# Altium project Yapa2.PrjPcb
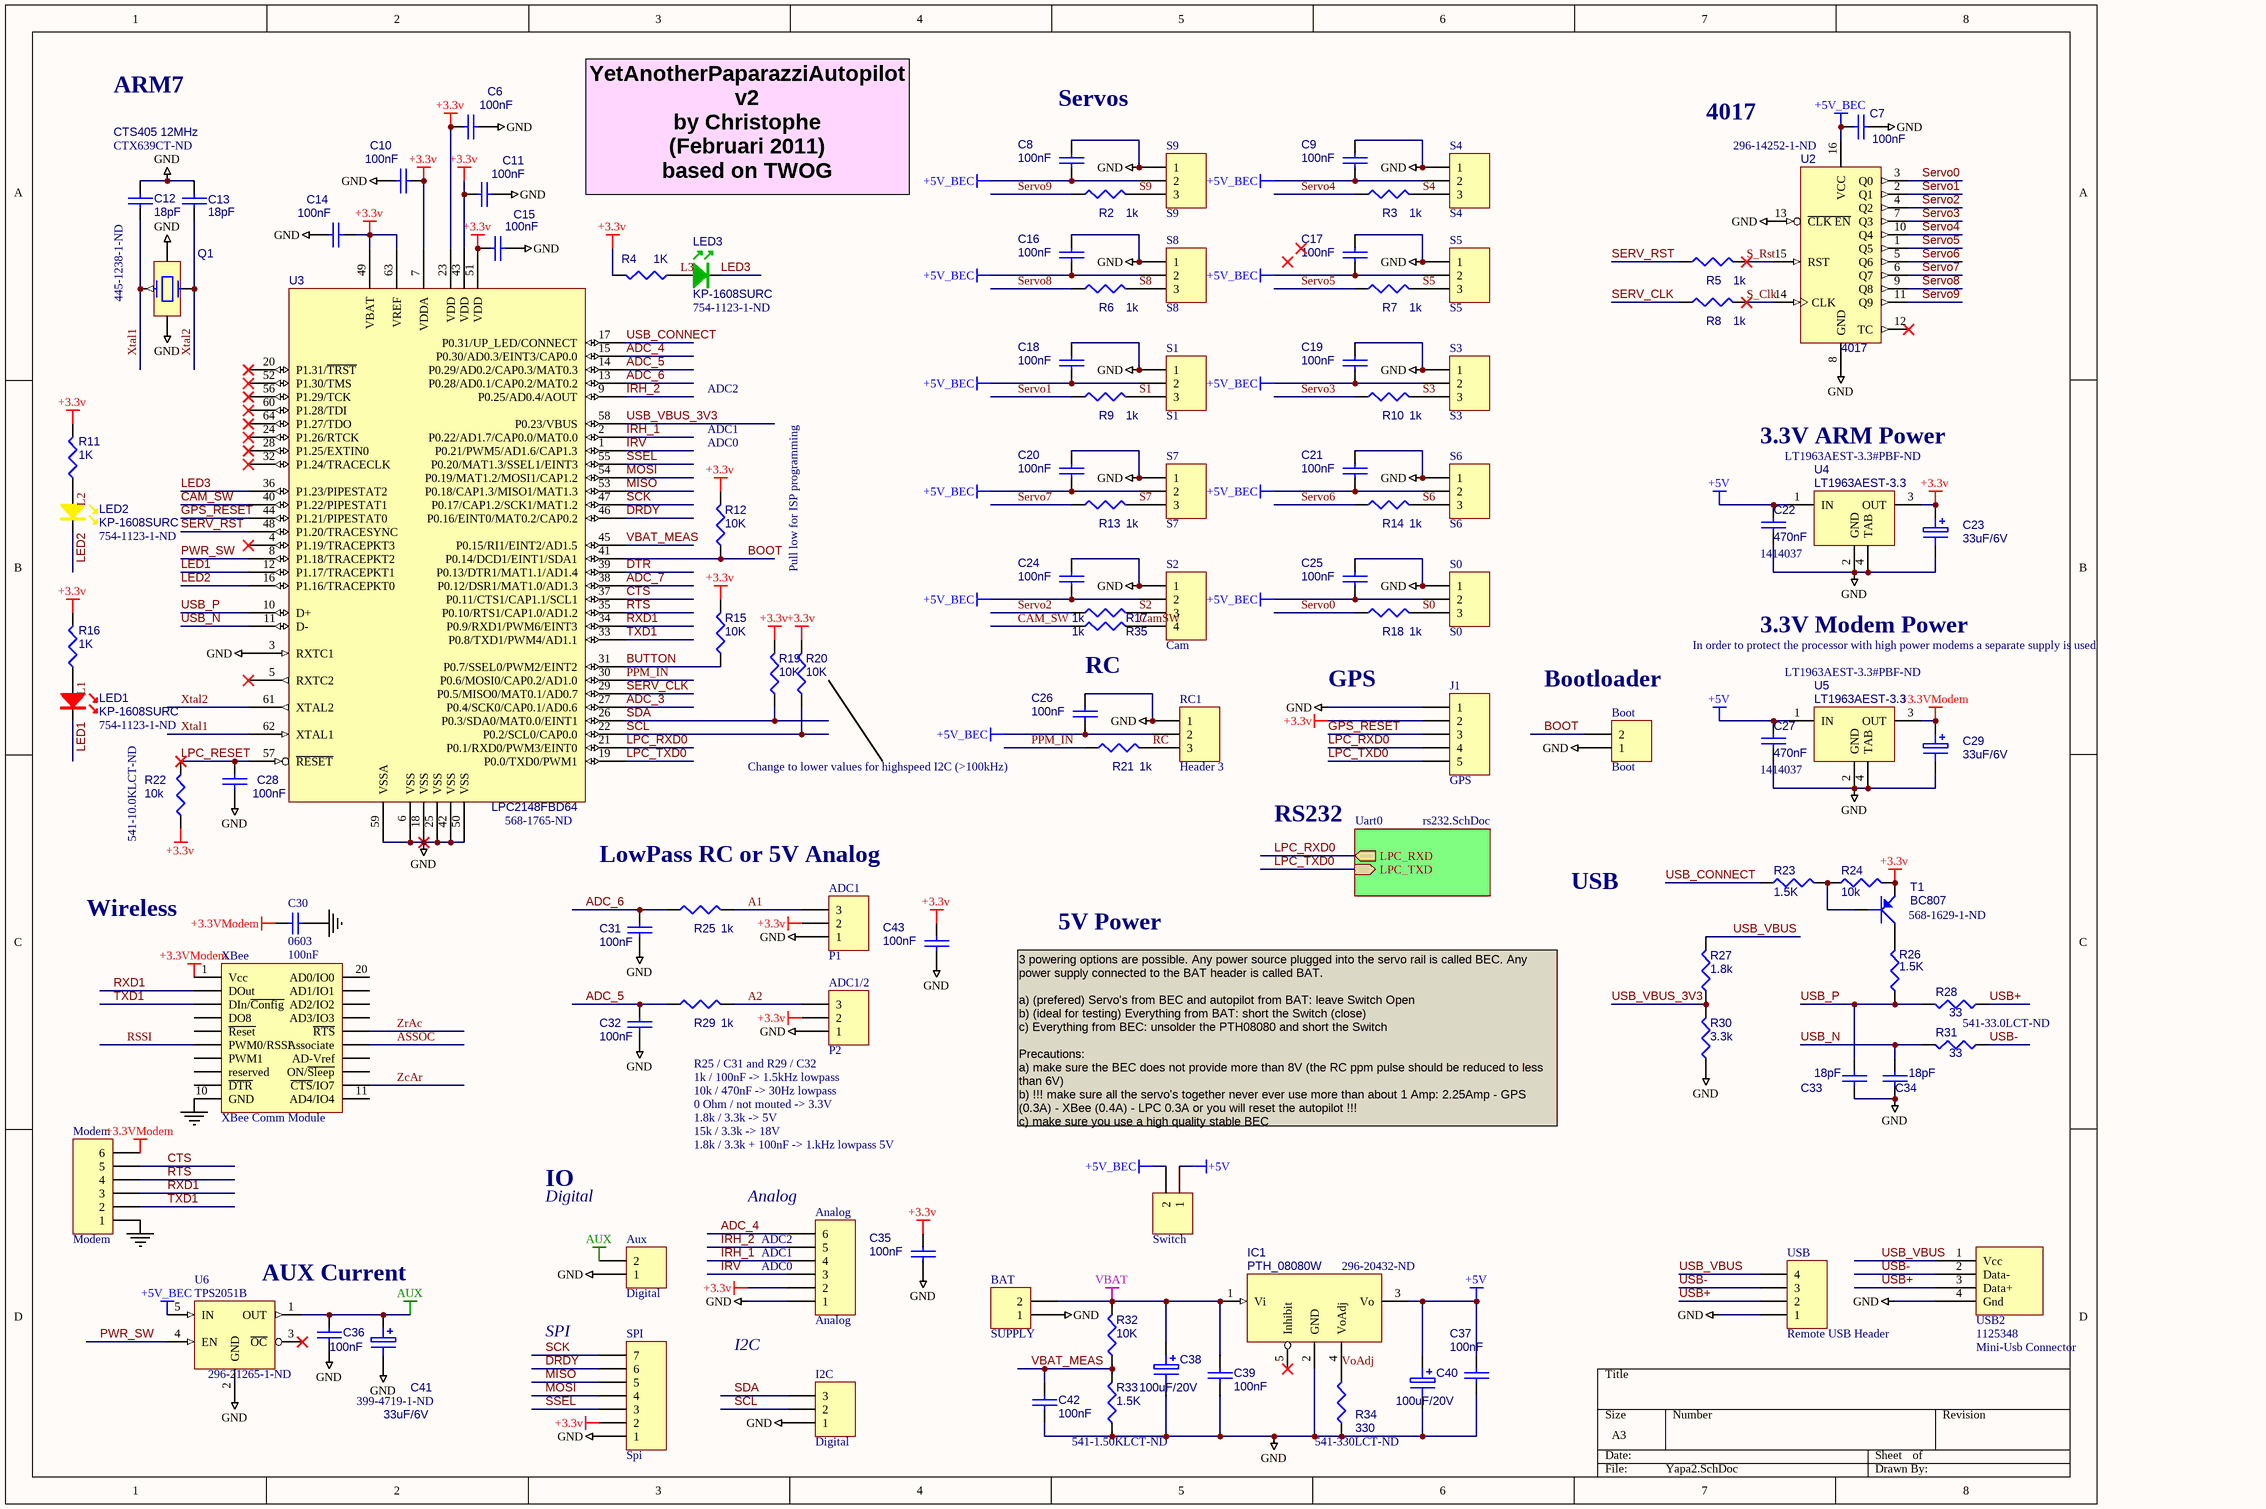
[diagram p0: Yapa2.SchDoc]
2 sheets, 116 parts. Net scope: hierarchical (ports join the sheet entries above them; power ports are global).
Board file: Yapa2.PcbDoc
Sheets:
  Yapa2.SchDoc
    Uart0 = rs232.SchDoc

## Sheet Yapa2.SchDoc
size A3; PageSetup: Record=PageOptions|CenterHorizontal=True|CenterVertical=True|PrintScale=1.00|XCorrection=1.00|YCorrection=1.00|PrintKind=0|BorderSize=5000000|LeftOffset=0|BottomOffset=0|Orientation=2|PaperLength=1000|PaperWidth=1000|Scale=100|PaperSource=7|PrintQuality=-4|MediaType=1|DitherType=10|PaperKind=A4|PrintScaleMode=1

### Parts
ADC1  P1  [HDR3]
ADC1/2  P2  [HDR3]
Analog  Analog  [HDR6]
Aux  Digital  [HDR2]
BAT  SUPPLY  [HDR1X2]
Boot  Boot  [HDR1X2]
C6  100nF  [0603]
C7  100nF  [0603]
C8  100nF  [0603]
C9  100nF  [0603]
C10  100nF  [0603]
C11  100nF  [0603]
C12  18pF  Supplier Part Number 1: 445-1238-1-ND  [0603]
C13  18pF  [0603]
C14  100nF  [0603]
C15  100nF  [0603]
C16  100nF  [0603]
C17  100nF  [0603]
C18  100nF  [0603]
C19  100nF  [0603]
C20  100nF  [0603]
C21  100nF  [0603]
C22  470nF  farnell: 1414037  [0805]
C23  33uF/6V  [T491A]
C24  100nF  [0603]
C25  100nF  [0603]
C26  100nF  [0603]
C27  470nF  farnell: 1414037  [0805]
C28  100nF  [0603]
C29  33uF/6V  [T491A]
C30  0603  value 100nF  [0603]
C31  100nF  [0603]
C32  100nF  [0603]
C33  18pF  [0603]
C34  18pF  [0603]
C35  100nF  [0603]
C36  100nF  [0603]
C37  100nF  [0603]
C38  100uF/20V  [T491D]
C39  100nF  [0603]
C40  100uF/20V  [T491D]
C41  33uF/6V  Supplier Part Number 1: 399-4719-1-ND  [T491A]
C42  100nF  [0603]
C43  100nF  [0603]
I2C  Digital  [HDR3]
IC1  PTH_08080W  Supplier Part Number 1: 296-20432-ND  [PTH_08080W]
J1  GPS  [HDR5]
LED1  KP-1608SURC  Supplier Part Number 1: 754-1123-1-ND  [KP-1608SURC]
LED2  KP-1608SURC  Supplier Part Number 1: 754-1123-1-ND  [KP-1608SURC]
LED3  KP-1608SURC  Supplier Part Number 1: 754-1123-1-ND  [KP-1608SURC]
Modem  Modem  [HDR1X6]
Q1  CTS405 12MHz  Supplier Part Number 1: CTX639CT-ND  [CTS_405]
R2  1k  [0603RES]
R3  1k  [0603RES]
R4  1K  [0603RES]
R5  1k  [0603RES]
R6  1k  [0603RES]
R7  1k  [0603RES]
R8  1k  [0603RES]
R9  1k  [0603RES]
R10  1k  [0603RES]
R11  1K  [0603RES]
R12  10K  [0603RES]
R13  1k  [0603RES]
R14  1k  [0603RES]
R15  10K  [0603RES]
R16  1K  [0603RES]
R17  1k  [0603RES]
R18  1k  [0603RES]
R19  10K  [0603RES]
R20  10K  [0603RES]
R21  1k  [0603RES]
R22  10k  Supplier Part Number 1: 541-10.0KLCT-ND  [0603RES]
R23  1.5K  [0603RES]
R24  10k  [0603RES]
R25  1k  [0603RES]
R26  1.5K  [0603RES]
R27  1.8k  [0603RES]
R28  33  Supplier Part Number 1: 541-33.0LCT-ND  [0603RES]
R29  1k  [0603RES]
R30  3.3k  [0603RES]
R31  33  [0603RES]
R32  10K  [0603RES]
R33  1.5K  Supplier Part Number 2: 541-1.50KLCT-ND  [0603RES]
R34  330  Supplier Part Number 1: 541-330LCT-ND  [0603RES]
R35  1k  [0603RES]
RC1  Header 3  [HDR3]
S0  S0  [HDR3]
S1  S1  [HDR3]
S2  Cam  [HDR4]
S3  S3  [HDR3]
S4  S4  [HDR3]
S5  S5  [HDR3]
S6  S6  [HDR3]
S7  S7  [HDR3]
S8  S8  [HDR3]
S9  S9  [HDR3]
SPI  Spi  [HDR7]
Switch  SUPPLY  [HDR1X2]  (value not drawn)
T1  BC807  Supplier Part Number 1: 568-1629-1-ND  [BC807]
U2  4017  Supplier Part Number 1: 296-14252-1-ND  [4017PW]
U3  LPC2148FBD64  Supplier Part Number 1: 568-1765-ND  [LPC2148FBD64]
U4  LT1963AEST-3.3  Supplier Part Number 1: LT1963AEST-3.3#PBF-ND  [LM3940IMP-3.3]
U5  LT1963AEST-3.3  Supplier Part Number 1: LT1963AEST-3.3#PBF-ND  [LM3940IMP-3.3]
U6  TPS2051B  Supplier Part Number 1: 296-21265-1-ND  [TPS2051B]
USB  Remote USB Header  [HDR4]
USB2  Mini-Usb Connector  Farnell: 1125348  [miniUSB]
XBee  XBee Comm Module  [Xbee]

### Sub-sheets
Uart0 = rs232.SchDoc: LPC_RXD (out), LPC_TXD (in)

### Nets
+3.3v: ADC1.2 ADC1/2.2 Analog.2 C6.1 C10.2 C11.1 C14.2 C15.2 C23.1 C35.2 C43.2 J1.2 R4.2 R11.2 R12.2 R15.2 R16.2 R19.2 R20.2 R22.1 R24.2 SPI.2 T1.2(E) U3.7(VDDA) U3.23(VDD) U3.43(VDD) U3.49(VBAT) U3.51(VDD) U3.63(VREF) U4.3(OUT)
+3.3VModem: C29.1 C30.2 Modem.6 U5.3(OUT) XBee.1(Vcc)
+5V: C22.1 C27.1 C37.1 C40.1 IC1.3(Vo) Switch.1 U4.1(IN) U5.1(IN)
+5V_BEC: C7.1 C8.1 C9.1 C16.1 C17.1 C18.1 C19.1 C20.1 C21.1 C24.1 C25.1 C26.1 RC1.2 S0.2 S1.2 S2.2 S3.2 S4.2 S5.2 S6.2 S7.2 S8.2 S9.2 Switch.2 U2.16(VCC) U6.5(IN)
AUX: Aux.2 C36.1 C41.1 U6.1(OUT)
GND: ADC1.1 ADC1/2.1 Analog.1 Aux.1 BAT.1 Boot.1 C6.2 C7.2 C8.2 C9.2 C10.1 C11.2 C12.1 C13.1 C14.1 C15.1 C16.2 C17.2 C18.2 C19.2 C20.2 C21.2 C22.2 C23.2 C24.2 C25.2 C26.2 C27.2 C28.2 C29.2 C30.1 C31.1 C32.1 C33.2 C34.2 C35.1 C36.2 C37.2 C38.2 C39.2 C40.2 C41.2 C42.2 C43.1 I2C.1 IC1.2(GND) J1.1 Modem.1 Q1.2 Q1.4 R30.1 R33.1 R34.1 RC1.1 S0.1 S1.1 S2.1 S3.1 S4.1 S5.1 S6.1 S7.1 S8.1 S9.1 SPI.1 U2.8(GND) U2.13(~{CLK_EN}) U3.3(RXTC1) U3.6(VSS) U3.18(VSS) U3.25(VSS) U3.42(VSS) U3.50(VSS) U3.59(VSSA) U4.2(GND) U4.4(TAB) U5.2(GND) U5.4(TAB) U6.2(GND) USB.1 USB2.4(Gnd) XBee.10(GND)  [also labelled TAB]
VBAT: BAT.2 C38.1 C39.1 IC1.1(Vi) R32.2
A1: ADC1.3 R25.2
A2: ADC1/2.3 R29.2
ADC_3: U3.27(P0.4/SCK0/CAP0.1/AD0.6)
ADC_4: Analog.6 U3.15(P0.30/AD0.3/EINT3/CAP0.0)
ADC_5: C32.2 R29.1 U3.14(P0.29/AD0.2/CAP0.3/MAT0.3)
ADC_6: C31.2 R25.1 U3.13(P0.28/AD0.1/CAP0.2/MAT0.2)
ADC_7: U3.38(P0.12/DSR1/MAT1.0/AD1.3)
ASSOC: XBee.15(Associate)
BOOT: Boot.2 R12.1 U3.41(P0.14/DCD1/EINT1/SDA1)
BUTTON: R15.1 U3.31(P0.7/SSEL0/PWM2/EINT2)
CAM_SW: R35.1 U3.40(P1.22/PIPESTAT1)
CamSW: R35.2 S2.4
CTS: Modem.5 U3.37(P0.11/CTS1/CAP1.1/SCL1)
DRDY: SPI.6 U3.46(P0.16/EINT0/MAT0.2/CAP0.2)
DTR: U3.39(P0.13/DTR1/MAT1.1/AD1.4)
GPS_RESET: J1.3 U3.44(P1.21/PIPESTAT0)
IRH_1: Analog.4 U3.2(P0.22/AD1.7/CAP0.0/MAT0.0)
IRH_2: Analog.5 U3.9(P0.25/AD0.4/AOUT)
IRV: Analog.3 U3.1(P0.21/PWM5/AD1.6/CAP1.3)
L1: LED1.1(A) R16.1
L2: LED2.1(A) R11.1
L3: LED3.1(A) R4.1
LED1: LED1.2(K) U3.12(P1.17/TRACEPKT1)
LED2: LED2.2(K) U3.16(P1.16/TRACEPKT0)
LED3: LED3.2(K) U3.36(P1.23/PIPESTAT2)
LPC_RESET: C28.1 R22.2 U3.57(~{RESET})
LPC_RXD0: J1.4 U3.21(P0.1/RXD0/PWM3/EINT0) ; sheet Uart0/LPC_RXD  [project net LPC_RXD]
LPC_TXD0: J1.5 U3.19(P0.0/TXD0/PWM1) ; sheet Uart0/LPC_TXD  [project net LPC_TXD]
MISO: SPI.5 U3.53(P0.18/CAP1.3/MISO1/MAT1.3)
MOSI: SPI.4 U3.54(P0.19/MAT1.2/MOSI1/CAP1.2)
PPM_IN: R21.1 U3.30(P0.6/MOSI0/CAP0.2/AD1.0)
PWR_SW: U3.8(P1.18/TRACEPKT2) U6.4(EN)
RC: R21.2 RC1.3
RSSI: XBee.6(PWM0/RSSI)
RTS: Modem.4 U3.35(P0.10/RTS1/CAP1.0/AD1.2)
RXD1: Modem.3 U3.34(P0.9/RXD1/PWM6/EINT3) XBee.2(DOut)
S0: R18.2 S0.3
S1: R9.2 S1.3
S2: R17.2 S2.3
S3: R10.2 S3.3
S4: R3.2 S4.3
S5: R7.2 S5.3
S6: R14.2 S6.3
S7: R13.2 S7.3
S8: R6.2 S8.3
S9: R2.2 S9.3
S_Clk: R8.2 U2.14(CLK)
S_Rst: R5.2 U2.15(RST)
SCK: SPI.7 U3.47(P0.17/CAP1.2/SCK1/MAT1.2)
SCL: I2C.2 R20.1 U3.22(P0.2/SCL0/CAP0.0)
SDA: I2C.3 R19.1 U3.26(P0.3/SDA0/MAT0.0/EINT1)
SERV_CLK: R8.1 U3.29(P0.5/MISO0/MAT0.1/AD0.7)
SERV_RST: R5.1 U3.48(P1.20/TRACESYNC)
Servo0: R18.1 U2.3(Q0)
Servo1: R9.1 U2.2(Q1)
Servo2: R17.1 U2.4(Q2)
Servo3: R10.1 U2.7(Q3)
Servo4: R3.1 U2.10(Q4)
Servo5: R7.1 U2.1(Q5)
Servo6: R14.1 U2.5(Q6)
Servo7: R13.1 U2.6(Q7)
Servo8: R6.1 U2.9(Q8)
Servo9: R2.1 U2.11(Q9)
SSEL: SPI.3 U3.55(P0.20/MAT1.3/SSEL1/EINT3)
TXD1: Modem.2 U3.33(P0.8/TXD1/PWM4/AD1.1) XBee.3(DIn/~{Config})
USB+: R28.1 USB.2 USB2.3(Data+)
USB-: R31.1 USB.3 USB2.2(Data-)
USB_CONNECT: R23.1 U3.17(P0.31/UP_LED/CONNECT)
USB_N: C34.1 R31.2 U3.11(D-)
USB_P: C33.1 R26.1 R28.2 U3.10(D+)
USB_VBUS: R27.2 USB.4 USB2.1(Vcc)
USB_VBUS_3V3: R27.1 R30.2 U3.58(P0.23/VBUS)
VBAT_MEAS: C42.1 R32.1 R33.2 U3.45(P0.15/RI1/EINT2/AD1.5)
VoAdj: IC1.4(VoAdj) R34.2
Xtal1: C12.2 Q1.1 U3.62(XTAL1)
Xtal2: C13.2 Q1.3 U3.61(XTAL2)
ZcAr: XBee.12(~{CTS}/IO7)
ZrAc: XBee.16(~{RTS})
NetR23_2: R23.2 R24.1 T1.1(B)
NetR26_2: R26.2 T1.3(C)

Not connected (* = marked no-connect by the designer): IC1 5(Inhibit)*; U2 12(TC)*; U3 4(P1.19/TRACEPKT3)* 5(RXTC2)* 20(P1.31/~{TRST})* 24(P1.26/RTCK)* 28(P1.25/EXTIN0)* 32(P1.24/TRACECLK)* 52(P1.30/TMS)* 56(P1.29/TCK)* 60(P1.28/TDI)* 64(P1.27/TDO)*; U6 3(~{OC})*; XBee 4(DO8) 5(~{Reset}) 7(PWM1) 8(reserved) 9(~{DTR}) 11(AD4/IO4) 13(ON/~{Sleep}) 14(AD-Vref) 17(AD3/IO3) 18(AD2/IO2) 19(AD1/IO1) 20(AD0/IO0)

### Notes on the sheet
- ARM7
- Servos
- 4017
- YetAnotherPaparazziAutopilot v2
  by Christophe
  (Februari 2011)
  based on TWOG
- ADC0
- ADC1
- ADC2
- 3.3V ARM Power
- Pull low for ISP programming
- In order to protect the processor with high power modems a separate supply is used
- 3.3V Modem Power
- RC
- GPS
- (near Boot) Bootloader
- Change to lower values for highspeed I2C (>100kHz)
- RS232
- Wireless
- LowPass RC or 5V Analog
- USB
- 5V Power
- (near ADC1/2) R25 / C31 and R29 / C32
- (near ADC1/2) 1k / 100nF -> 1.5kHz lowpass
- 0 Ohm / not mouted -> 3.3V
- 1.8k / 3.3k -> 5V
- 10k / 470nF -> 30Hz lowpass
- 3 powering options are possible. Any power source plugged into the servo rail is called BEC. Any power supply connected to the BAT header is called BAT.
  a) (prefered) Servo's from BEC and autopilot from BAT: leave Switch Open
  b) (ideal for testing) Everything from BAT: short the Switch (close)
  c) Everything from BEC: unsolder the PTH08080 and short the Switch
  Precautions:
  a) make sure the BEC does not provide more than 8V (the RC ppm pulse should be reduced to less than 6V)
  b) !!! make sure all the servo's together never ever use more than about 1 Amp: 2.25Amp - GPS (0.3A) - XBee (0.4A) - LPC 0.3A or you will reset the autopilot !!!
  c) make sure you use a high quality stable BEC
- IO
- 15k / 3.3k -> 18V
- 1.8k / 3.3k + 100nF -> 1.kHz lowpass 5V
- Digital
- (near Analog) Analog
- (near Analog) ADC1
- (near Analog) ADC2
- AUX Current
- (near Analog) ADC0
- SPI
- I2C

### Library data of the parts
ADC1 ADC1/2 I2C RC1 S0 S1 S3-S9 = Header 3: Header, 3-Pin; LatestRevisionDate: 17-Jul-2002; LatestRevisionNote: Re-released for DXP Platform.; Publisher: Altium Limited
Analog Modem = Header 6: Header, 6-Pin; LatestRevisionDate: 17-Jul-2002; LatestRevisionNote: Re-released for DXP Platform.; Publisher: Altium Limited
Aux BAT Boot Switch = Header 2: Header, 2-Pin; LatestRevisionDate: 17-Jul-2002; LatestRevisionNote: Re-released for DXP Platform.; Publisher: Altium Limited
C6-C22 C24-C28 C31-C37 C39 C42 C43 = CAP
  C12: Supplier 1: Digi-Key
C23 C29 C38 C40 C41 = ELECTRO1
  C38 C40: Part Field 2: TAJ D 107K 020R; Part Field 3: Farnell; Part Field 4: 113-5058
  C41: Supplier 1: Digi-Key
C30 = Cap: Capacitor; Published: 8-Jun-2000; Revision: July-2002: Re-released for DXP Platform.; Publisher: Altium Limited
J1 = Header 5: Header, 5-Pin; LatestRevisionDate: 17-Jul-2002; LatestRevisionNote: Re-released for DXP Platform.; Publisher: Altium Limited
LED1 = KP-1608SURC: Led rouge 0603 (GRZ 10/2007); Supplier 1: Digi-Key
LED2 = KP-1608SURC_1: Led jaune 0603; Supplier 1: Digi-Key
LED3 = KP-1608SURC: Led vert 0603; Supplier 1: Digi-Key
Q1 = CRYSTAL_CTS_405: Crystal 12 Mhz SMD (DMT 06/2007); Text Field1: CTS-Frequency Controls; Text Field2: 405C 35B 12M0000; Text Field3: Digikey; Text Field4: CTX639CT-ND; Supplier 1: Digi-Key
R2-R35 = RES1
  R22 R27 R28 R30 R34: Supplier 1: Digi-Key
  R33: Supplier 1: Digi-Key; Supplier 2: Digi-Key
S2 USB = Header 4: Header, 4-Pin; LatestRevisionDate: 17-Jul-2002; LatestRevisionNote: Re-released for DXP Platform.; Publisher: Altium Limited
SPI = Header 7: Header, 7-Pin; LatestRevisionDate: 17-Jul-2002; LatestRevisionNote: Re-released for DXP Platform.; Publisher: Altium Limited
T1 = BC807: PNP general purpose transistor ( GRZ 10/2007 ); Supplier 1: Digi-Key
U3 = LPC2148FBD64: Single-chip ARM7 32-bit microcontroller (GRZ 04/2007); Supplier 1: Digi-Key
U4 U5 = LM3940IMP-3.3: Régulateur 3.3v LDO ( GRZ 09/2007); Supplier 1: Digi-Key
U6 = TPS2051B: Current Limited Power Distribution Switch (GRZ 10/2007); Supplier 1: Digi-Key
USB2 = USB_Host: Mini USB Connector; pin to pad: 1>VBus 2>D- 3>D+ 4>GND
XBee = Xbee: Header, 10-Pin, Dual row; LatestRevisionDate: 17-Jul-2002; LatestRevisionNote: Re-released for DXP Platform.; Publisher: Altium Limited
IC1 = PTH_08080W: Supplier 1: Digi-Key
U2 = 4017: Supplier 1: Digi-Key

## Sheet rs232.SchDoc
size A4
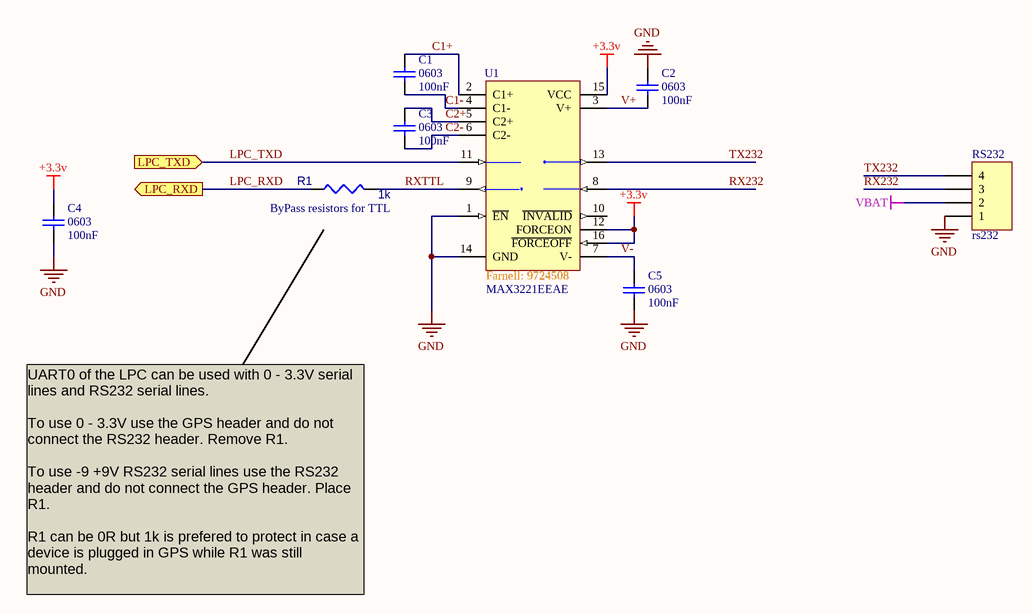
[diagram p1: rs232.SchDoc]

### Parts
C1  0603  value 100nF  [0603]
C2  0603  value 100nF  [0603]
C3  0603  value 100nF  [0603]
C4  0603  value 100nF  [0603]
C5  0603  value 100nF  [0603]
R1  1k  [0603RES]
RS232  rs232  [HDR4]
U1  MAX3221EEAE  Farnell: 9724508  [SSOP16]

### Ports
LPC_RXD (out), LPC_TXD (in)

### Nets
+3.3v: C4.2 U1.12(FORCEON) U1.15(VCC) U1.16(~{FORCEOFF})
GND: C2.2 C4.1 C5.1 RS232.1 U1.1(~{EN}) U1.14(GND)
VBAT: RS232.2
C1+: C1.2 U1.2(C1+)
C1-: C1.1 U1.4(C1-)
C2+: C3.2 U1.5(C2+)
C2-: C3.1 U1.6(C2-)
LPC_RXD: R1.1 ; port LPC_RXD
LPC_TXD: U1.11(T1IN) ; port LPC_TXD
RX232: RS232.3 U1.8(R1IN)
RXTTL: R1.2 U1.9(R1OUT)
TX232: RS232.4 U1.13(T1OUT)
V+: C2.1 U1.3(V+)
V-: C5.2 U1.7(V-)

Not connected (* = marked no-connect by the designer): U1 10(~{INVALID})

### Notes on the sheet
- (near R1) ByPass resistors for TTL
- UART0 of the LPC can be used with 0 - 3.3V serial lines and RS232 serial lines.
  To use 0 - 3.3V use the GPS header and do not connect the RS232 header. Remove R1.
  To use -9 +9V RS232 serial lines use the RS232 header and do not connect the GPS header. Place R1.
  R1 can be 0R but 1k is prefered to protect in case a device is plugged in GPS while R1 was still mounted.

### Library data of the parts
C1-C3 C5 = Cap: Capacitor; Published: 8-Jun-2000; LatestRevisionDate: 17-Jul-2002; LatestRevisionNote: Re-released for DXP Platform.; PackageReference: RAD-0.3; Publisher: Altium Limited
C4 = Cap: Capacitor; Voltage: 50V; Rating: X7R; id: 68; Type: Ceramic; Published: 8-Jun-2000; LatestRevisionDate: 17-Jul-2002; LatestRevisionNote: Re-released for DXP Platform.; PackageReference: RAD-0.3; Publisher: Altium Limited; Footprint Ref: 0603; Library Ref: Cap; Price: 0.0145; DigiKey: 709-1161-1-ND
R1 = RES1
RS232 = Header 4: Header, 4-Pin; LatestRevisionDate: 17-Jul-2002; LatestRevisionNote: Re-released for DXP Platform.; Publisher: Altium Limited
U1 = MAX3221EEAE: ±15kV ESD-Protected, 1µA, 3.0V/5.5V, 250kbps, RS-232 Transceiver with AutoShutdown; Published: 16-Jan-2001; LatestRevisionDate: 06-Jun-2005; LatestRevisionNote: Stylized 3D Model Added.; DatasheetVersion: Jan-1998; PackageVersion: 1996; PackageReference: SSOP16; Publisher: Altium Limited; PackageDescription: SSOP; 16 Leads; Body Width 5.3 mm; Pitch 0.65 mm; ComponentLink1Description: Manufacturer Link; ComponentLink1URL: http://www.maxim-ic.com/; ComponentLink2Description: Datasheet; ComponentLink2URL: http://pdfserv.maxim-ic.com/en/ds/MAX3221E-MAX3243E.pdf

## Nets that join several sheets
+3.3v: Yapa2 (30 pins), rs232 (C4.2 U1.12 U1.15 U1.16)
GND: Yapa2 (82 pins), rs232 (6 pins)
VBAT: Yapa2 (5 pins), rs232 (RS232.2)
LPC_RXD: Yapa2 (J1.4 U3.21), rs232 (R1.1)
LPC_TXD: Yapa2 (J1.5 U3.19), rs232 (U1.11)

## Assembly variants
No_RS232: not fitted Boot C1 C2 C3 C4 C5 Modem R1 RS232 U1 USB
Full: not fitted Boot Modem USB
Minimal: not fitted ADC1 ADC1/2 Analog Aux BAT Boot C1 C2 C3 C4 C5 C9 C17 C19 C21 C25 C27 C29 C31 C32 C36 C41 I2C J1 LED1 LED3 Modem R1 R4 R16 RC1 RS232 S0 S1 S2 S3 S4 S5 S6 S7 S8 S9 SPI Switch U1 U5 U6 USB USB2 XBee